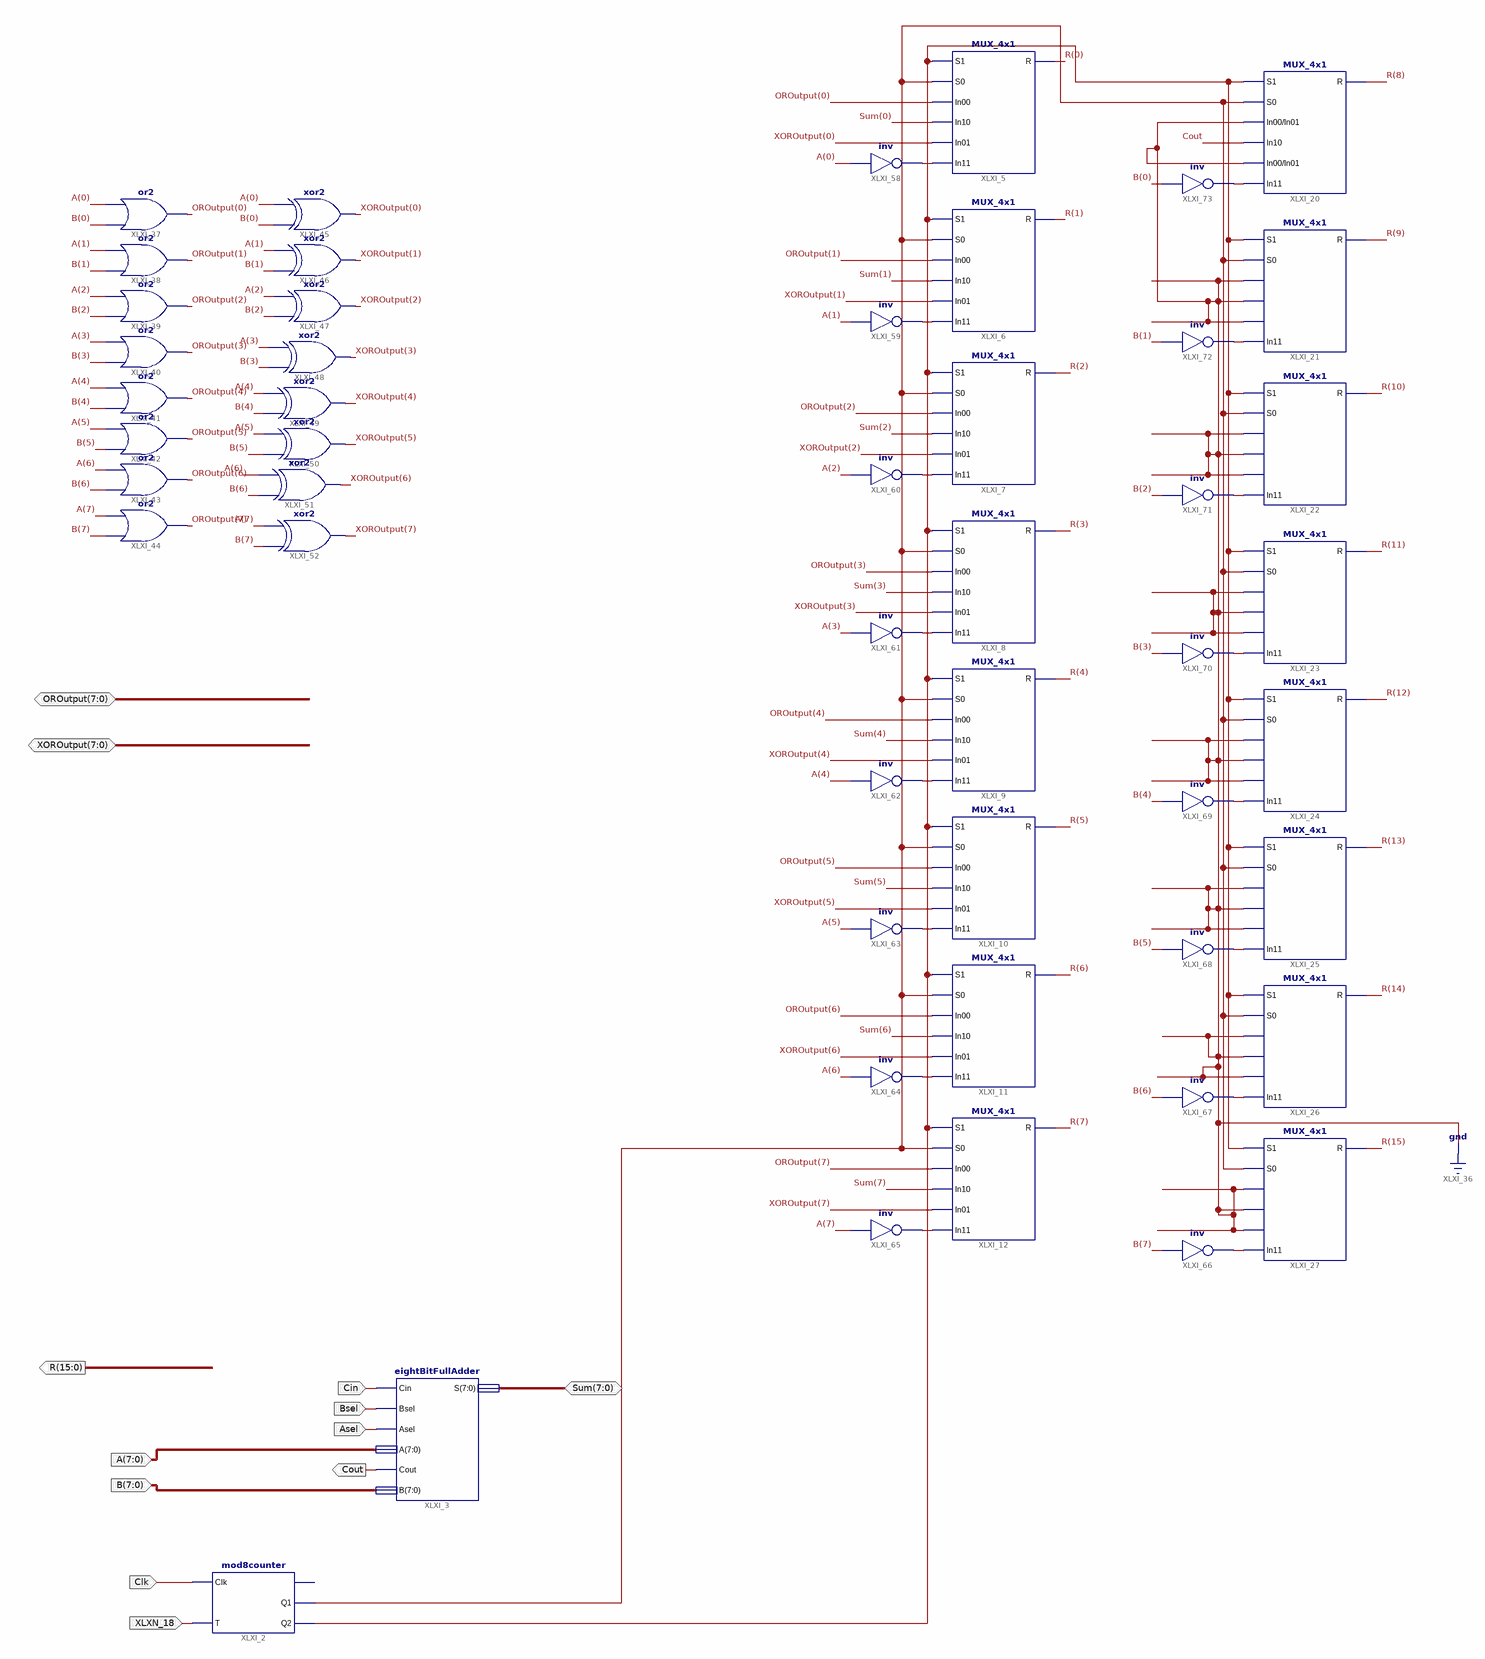
[diagram p0: schematic sheet 1]
// Xilinx ISE schematic first_d.sch (spartan3) as structural Verilog: 50 symbols, 12 ports
module first_d (
  input  Clk,
  input  [7:0] A,
  input  [7:0] B,
  input  Bsel,
  input  Asel,
  input  Cin,
  input  XLXN_18,
  inout  [7:0] Sum,
  inout  [7:0] OROutput,
  inout  [7:0] XOROutput,
  output Cout,
  output [15:0] R
);

  wire XLXN_43, XLXN_135, XLXN_136, XLXN_137, XLXN_138, XLXN_139, XLXN_140, XLXN_141, XLXN_142, XLXN_143,
       XLXN_144, XLXN_145, XLXN_146, XLXN_147, XLXN_148, XLXN_149, XLXN_150, XLXN_200;

  mod8counter XLXI_2 (.Clk(Clk), .T(XLXN_18), .Q1(XLXN_200), .Q2(XLXN_43));  // open: Q0
  eightBitFullAdder XLXI_3 (.Cin(Cin), .Bsel(Bsel), .Asel(Asel), .A(A), .B(B), .Cout(Cout), .S(Sum));
  MUX_4x1 XLXI_20 (.S1(XLXN_43), .S0(XLXN_200), .In00(1'b0), .In10(Cout), .In01(1'b0), .In11(XLXN_150), .R(R[8]));
  MUX_4x1 XLXI_21 (.S1(XLXN_43), .S0(XLXN_200), .In00(1'b0), .In10(1'b0), .In01(1'b0), .In11(XLXN_149), .R(R[9]));
  MUX_4x1 XLXI_22 (.S1(XLXN_43), .S0(XLXN_200), .In00(1'b0), .In10(1'b0), .In01(1'b0), .In11(XLXN_148), .R(R[10]));
  MUX_4x1 XLXI_23 (.S1(XLXN_43), .S0(XLXN_200), .In00(1'b0), .In10(1'b0), .In01(1'b0), .In11(XLXN_147), .R(R[11]));
  MUX_4x1 XLXI_24 (.S1(XLXN_43), .S0(XLXN_200), .In00(1'b0), .In10(1'b0), .In01(1'b0), .In11(XLXN_146), .R(R[12]));
  MUX_4x1 XLXI_25 (.S1(XLXN_43), .S0(XLXN_200), .In00(1'b0), .In10(1'b0), .In01(1'b0), .In11(XLXN_145), .R(R[13]));
  MUX_4x1 XLXI_26 (.S1(XLXN_43), .S0(XLXN_200), .In00(1'b0), .In10(1'b0), .In01(1'b0), .In11(XLXN_144), .R(R[14]));
  MUX_4x1 XLXI_27 (.S1(XLXN_43), .S0(XLXN_200), .In00(1'b0), .In10(1'b0), .In01(1'b0), .In11(XLXN_143), .R(R[15]));
  MUX_4x1 XLXI_12 (
    .S1(XLXN_43), .S0(XLXN_200), .In00(OROutput[7]), .In10(Sum[7]), .In01(XOROutput[7]), .In11(XLXN_142),
    .R(R[7]));
  MUX_4x1 XLXI_11 (
    .S1(XLXN_43), .S0(XLXN_200), .In00(OROutput[6]), .In10(Sum[6]), .In01(XOROutput[6]), .In11(XLXN_141),
    .R(R[6]));
  MUX_4x1 XLXI_10 (
    .S1(XLXN_43), .S0(XLXN_200), .In00(OROutput[5]), .In10(Sum[5]), .In01(XOROutput[5]), .In11(XLXN_140),
    .R(R[5]));
  MUX_4x1 XLXI_9 (
    .S1(XLXN_43), .S0(XLXN_200), .In00(OROutput[4]), .In10(Sum[4]), .In01(XOROutput[4]), .In11(XLXN_139),
    .R(R[4]));
  MUX_4x1 XLXI_8 (
    .S1(XLXN_43), .S0(XLXN_200), .In00(OROutput[3]), .In10(Sum[3]), .In01(XOROutput[3]), .In11(XLXN_138),
    .R(R[3]));
  MUX_4x1 XLXI_7 (
    .S1(XLXN_43), .S0(XLXN_200), .In00(OROutput[2]), .In10(Sum[2]), .In01(XOROutput[2]), .In11(XLXN_137),
    .R(R[2]));
  MUX_4x1 XLXI_6 (
    .S1(XLXN_43), .S0(XLXN_200), .In00(OROutput[1]), .In10(Sum[1]), .In01(XOROutput[1]), .In11(XLXN_136),
    .R(R[1]));
  MUX_4x1 XLXI_5 (
    .S1(XLXN_43), .S0(XLXN_200), .In00(OROutput[0]), .In10(Sum[0]), .In01(XOROutput[0]), .In11(XLXN_135),
    .R(R[0]));
  or XLXI_37 (OROutput[0], B[0], A[0]);
  or XLXI_38 (OROutput[1], B[1], A[1]);
  or XLXI_39 (OROutput[2], B[2], A[2]);
  or XLXI_40 (OROutput[3], B[3], A[3]);
  or XLXI_41 (OROutput[4], B[4], A[4]);
  or XLXI_42 (OROutput[5], B[5], A[5]);
  or XLXI_43 (OROutput[6], B[6], A[6]);
  or XLXI_44 (OROutput[7], B[7], A[7]);
  xor XLXI_45 (XOROutput[0], B[0], A[0]);
  xor XLXI_46 (XOROutput[1], B[1], A[1]);
  xor XLXI_47 (XOROutput[2], B[2], A[2]);
  xor XLXI_48 (XOROutput[3], B[3], A[3]);
  xor XLXI_49 (XOROutput[4], B[4], A[4]);
  xor XLXI_50 (XOROutput[5], B[5], A[5]);
  xor XLXI_51 (XOROutput[6], B[6], A[6]);
  xor XLXI_52 (XOROutput[7], B[7], A[7]);
  not XLXI_58 (XLXN_135, A[0]);
  not XLXI_59 (XLXN_136, A[1]);
  not XLXI_60 (XLXN_137, A[2]);
  not XLXI_61 (XLXN_138, A[3]);
  not XLXI_62 (XLXN_139, A[4]);
  not XLXI_63 (XLXN_140, A[5]);
  not XLXI_64 (XLXN_141, A[6]);
  not XLXI_65 (XLXN_142, A[7]);
  not XLXI_66 (XLXN_143, B[7]);
  not XLXI_67 (XLXN_144, B[6]);
  not XLXI_68 (XLXN_145, B[5]);
  not XLXI_69 (XLXN_146, B[4]);
  not XLXI_70 (XLXN_147, B[3]);
  not XLXI_71 (XLXN_148, B[2]);
  not XLXI_72 (XLXN_149, B[1]);
  not XLXI_73 (XLXN_150, B[0]);
endmodule
